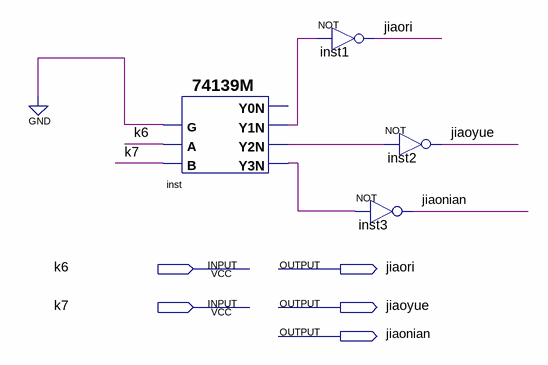
[diagram p0: schematic sheet]
// Quartus schematic rilifuyong.bdf as structural Verilog: 4 symbols, 5 pins
module rilifuyong (
  input  k6,
  input  k7,
  output jiaori,
  output jiaoyue,
  output jiaonian
);

  wire inst_y1n, inst_y2n, inst_y3n;

  \74139M  inst (.B(k7), .A(k6), .G(1'b0), .Y3N(inst_y3n), .Y2N(inst_y2n), .Y1N(inst_y1n));  // open: Y0N
  not inst1 (jiaori, inst_y1n);
  not inst2 (jiaoyue, inst_y2n);
  not inst3 (jiaonian, inst_y3n);
endmodule
